# Altium schematic sheet LED_Connector.SchDoc
size A; DocumentNumber: 7; SheetNumber: 8; SheetTotal: 9
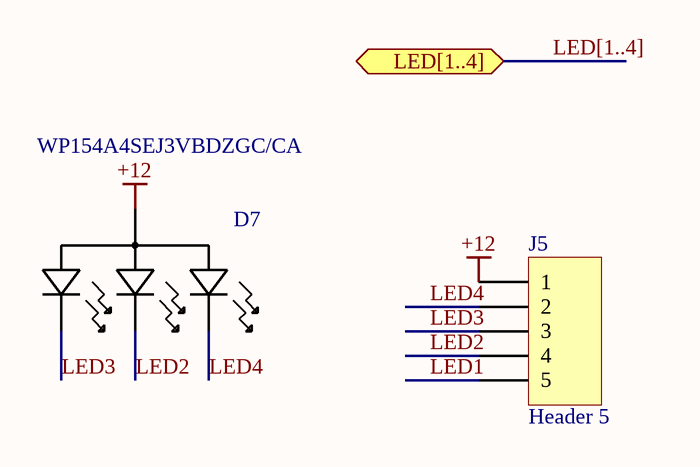
[diagram p0: LED_Connector.SchDoc]

## Parts
D7  WP154A4SEJ3VBDZGC/CA  [LED_RGB_5MM]
J5  Header 5  [CONN. 5]

## Ports
LED[1..4] (bidir)

## Nets
+12: D7.2 J5.1
LED1: J5.5
LED2: D7.3 J5.4
LED3: D7.1 J5.3
LED4: D7.4 J5.2

## Buses and harness runs
bus LED[1..4] = port LED[1..4]

## Library data of the parts
D7 = WP154A4SEJ3VBDZGC/CA: 5mm RGB Tri-Color Round Lamp; Mfr_Name: Kingbright; Type: DEV; Copyright: Copyright (C) 2022 Ultra Librarian. All rights reserved.; Manufacturer_Part_Number: WP154A4SEJ3VBDZGC/CA; Digi-Key_Part_Number_1: 754-2153-ND; Digi-Key_Part_Number_2: 754-2153-NDL; RefDes: RefDes
J5 = TermBlock 5: 5 Position Terminal Block Header, Male Pins, Shrouded (2 Side) 0.197" (5.00mm) 90°, Right Angle - Through Hole; LatestRevisionDate: 17-Jul-2002; LatestRevisionNote: Re-released for DXP Platform.; Publisher: Altium Limited